# EAGLE design interfaceBoard (EAGLE 7.6.0)
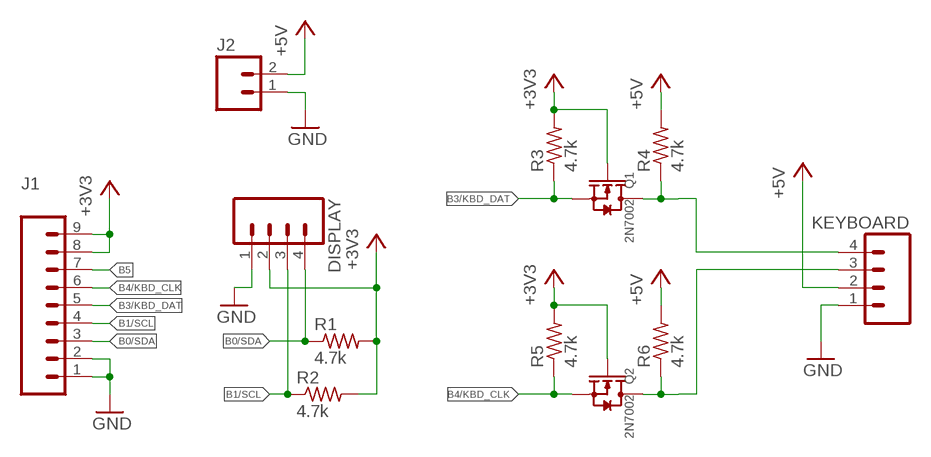
[diagram p0: schematic, sheet 1]

## Parts
DISPLAY  M04LOCK_LONGPADS  [1X04_LOCK_LONGPADS]
J1  M09LOCK-LONGPADS  [1X09_LOCK_LONGPADS]
J2  M02PTH3  [1X02_LONGPADS]
KEYBOARD  M04LOCK_LONGPADS  [1X04_LOCK_LONGPADS]
Q1  2N7002  SMD-MOSFET-N-CH-60V-300MA-LOGIC-LEVEL-FET-2N7002(SOT-23)  [SOT-23]
Q2  2N7002  SMD-MOSFET-N-CH-60V-300MA-LOGIC-LEVEL-FET-2N7002(SOT-23)  [SOT-23]
R1  4.7k  R-US_R0805  [R0805]
R2  4.7k  R-US_R0805  [R0805]
R3  4.7k  R-US_R0805  [R0805]
R4  4.7k  R-US_R0805  [R0805]
R5  4.7k  R-US_R0805  [R0805]
R6  4.7k  R-US_R0805  [R0805]

## Nets
+3V3: DISPLAY.2 J1.8 J1.9 Q1.1(G) Q2.1(G) R1.2 R2.2 R3.2 R5.2
+5V: J2.2 KEYBOARD.2 R4.2 R6.2
B0/SDA: DISPLAY.4 J1.3 R1.1
B1/SCL: DISPLAY.3 J1.4 R2.1
B3/KBD_DAT: J1.5 Q1.2(S) R3.1
B4/KBD_CLK: J1.6 Q2.2(S) R5.1
B5: J1.7
GND: DISPLAY.1 J1.1 J1.2 J2.1 KEYBOARD.1
N$2: KEYBOARD.4 Q1.3(D) R4.1
N$5: KEYBOARD.3 Q2.3(D) R6.1

## Library data of the parts
DISPLAY KEYBOARD = SparkFun-Connectors:M04: Header 4 Standard 4-pin 0.1" header. Use with straight break away headers (SKU : PRT-00116), right angle break away headers (PRT-00553), swiss pins (PRT-00743), machine pins (PRT-00117), and female headers (PRT-00115). Molex polarized connector foot print use with SKU : PRT-08231 with associated crimp pins and housings. 1MM SMD Version SKU: PRT-10208; PROD_ID: CONN-09696
J1 = SparkFun-Connectors:M09: Header 9 Standard 9-pin 0.1" header. Use with straight break away headers (SKU : PRT-00116), right angle break away headers (PRT-00553), swiss pins (PRT-00743), machine pins (PRT-00117), and female headers (PRT-00115).
J2 = SparkFun-Connectors:M02: Standard 2-pin 0.1" header. Use with - straight break away headers ( PRT-00116) - right angle break away headers (PRT-00553) - swiss pins (PRT-00743) - machine pins (PRT-00117) - female headers (PRT-00115) Molex polarized connector foot print use with: PRT-08233 with associated crimp pins and housings. 2.54_SCREWTERM for use with PRT-10571. 3.5mm Screw Terminal footprints for PRT-08084 5mm Screw Terminal footprints for use with PRT-08432
Q1 Q2 = Seeed-OPL-Transistor:SMD-MOSFET-N-CH-60V-300MA-LOGIC-LEVEL-FET-2N7002(SOT-23): 305030028; MPN: 2N7002,215
R1-R6 = rcl:R-US_: RESISTOR, American symbol

## Net classes
1 power: width 0.61 mm

## Board
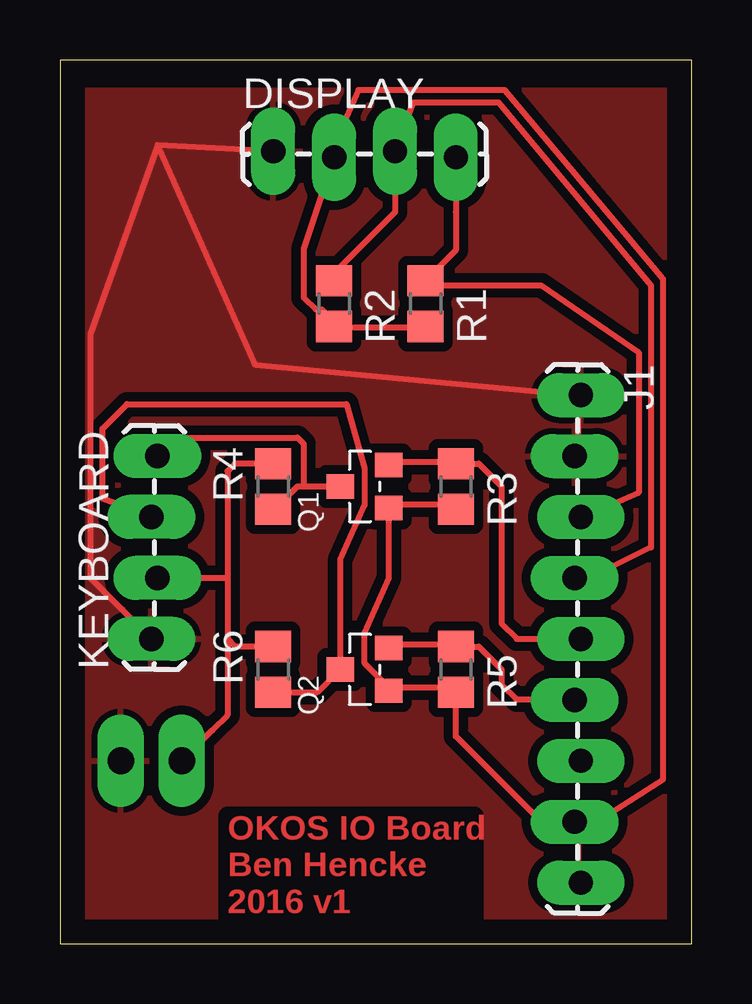
[diagram p1: board, top side]

Size 26.34 x 36.82 mm. Coordinates in mm from the lower left corner, seen from the top.
Outline: 0,0 26.34,0 26.34,36.82 0,36.82 0,0
Copper layers (1*16): Top 0.035mm / dielectric 1.5mm / Bottom 0.035mm
Design rules "bens homebrew *": minimum track width 10mil, minimum drill 24mil, track to track 10mil, track to pad 10mil, pad to pad 10mil, via to via 10mil, smd to smd 8mil, copper to edge 40mil, drill to drill 8mil, minimum pad ring 16mil, minimum via ring 16mil, stop-mask expansion 4mil, vias tented up to drill 0mil, thermal gap 10mil

### Footprints (pad centres in the part's own frame; a part is rotated, then mirrored left to right if it is on the bottom)
1X04_LOCK_LONGPADS = drill 1.016 long: 1 0,0; 2 2.54,-0.254; 3 5.08,0; 4 7.62,-0.254
1X09_LOCK_LONGPADS = drill 1.016 long: 1 0,0.127; 2 2.54,-0.127; 3 5.08,0.127; 4 7.62,-0.127; 5 10.16,0.127; 6 12.7,-0.127; 7 15.24,0.127; 8 17.78,-0.127; 9 20.32,0.127
1X02_LONGPADS = drill 1.118 pad 1.88 long: 1 0,0; 2 2.54,0
SOT-23 = smd 1.016 x 1.143: 1 -0.889,-1.016; 2 0.889,-1.016; 3 0,1.016
R0805 = smd 1.3 x 1.5: 1 -0.95,0; 2 0.95,0

### Placement (x,y rotation side)
DISPLAY  8.89,33.02 0 top
J1  21.59,22.86 270 top
J2  2.54,7.62 0 top
KEYBOARD  3.81,12.7 90 top
Q1  12.7,19.05 90 top
Q2  12.7,11.43 90 top
R1  15.24,26.67 270 top
R2  11.43,26.67 270 top
R3  16.51,19.05 270 top
R4  8.89,19.05 90 top
R5  16.51,11.43 270 top
R6  8.89,11.43 90 top

### Tracks (layer width: path | path; a pad name or v marks a point on that pad's centre or on a via)
+3V3
  Top 0.254: R1.2 15.24,25.65 11.43,25.65 R2.2 11.43,25.91 10.92,26.42 10.67,26.42 10.16,26.92 10.16,28.96 DISPLAY.2 11.43,33.27 12.45,35.56 18.54,35.56 25.15,27.69 25.15,6.86 21.59,4.57 | R3.2 16.51,18.29 13.72,18.29 Q1.1 13.72,18.03 13.72,15.24 12.7,12.95 12.7,11.68 13.72,10.67 | 13.72,10.67 16.51,10.67 R5.2 16.51,10.41 16.51,8.64 20.07,5.08 J1.8 | 13.72,10.67 Q2.1 13.72,10.67 | 21.59,4.57 21.59,5.08 J1.8 | 21.59,4.57 21.59,2.54 J1.9 | 21.59,4.57 J1.8
+5V
  Top 0.254: R4.2 7.3,20 6.99,19.68 6.99,15.24 | 6.99,15.24 6.99,12.7 | 6.99,12.7 6.99,9.53 6.35,8.89 J2.2 | R6.2 7.3,12.38 6.99,12.7 | KEYBOARD.2 6.99,15.24
B0/SDA
  Top 0.254: J1.3 21.84,17.78 24.13,18.8 24.13,24.64 20.07,27.43 15.24,27.43 R1.1 16.51,28.89 16.51,30.48 DISPLAY.4
B1/SCL
  Top 0.254: J1.4 21.59,15.24 22.1,15.24 24.64,16.51 24.64,27.43 18.29,35.05 14.73,35.05 DISPLAY.3 13.97,30.48 12.7,29.21 11.43,27.94 R2.1
B3/KBD_DAT
  Top 0.254: Q1.2 13.72,20.07 16.51,20.07 R3.1 17.46,20 18.41,19.05 18.41,13.34 19.05,12.7 J1.5
B4/KBD_CLK
  Top 0.254: Q2.2 13.72,12.45 16.51,12.45 R5.1 17.46,12.38 18.41,11.43 18.41,10.79 19.05,10.16 J1.6
GND
  Top 0.254: 21.59,22.86 21.59,20.32 J1.2 | 21.59,22.86 J1.1 21.59,22.86 | KEYBOARD.1 1.27,15.24 1.27,25.4 4.06,33.27 | DISPLAY.1 4.06,33.27 | 21.59,22.86 8.13,24.13 4.06,33.27
  pour Top (isolate 0.381): 0,35.56 25.4,35.56 25.4,0 0,0
N$2
  Top 0.254: 10.16,19.05 9.91,19.05 8.89,18.03 R4.1 | 10.16,19.05 Q1.3 | 10.16,19.05 10.16,20.83 9.91,21.08 4.83,21.08 KEYBOARD.4
N$5
  Top 0.254: KEYBOARD.3 1.78,18.54 1.78,21.46 2.79,22.48 11.94,22.48 12.7,19.81 12.7,18.29 11.68,16 Q2.3 10.73,10.48 R6.1

### Text on the board
Top: OKOS IO Board / Ben Hencke / 2016 v1